# Altium project AJMG 2550XD Silver Jubilee.PrjPcb (part 2 of 2)
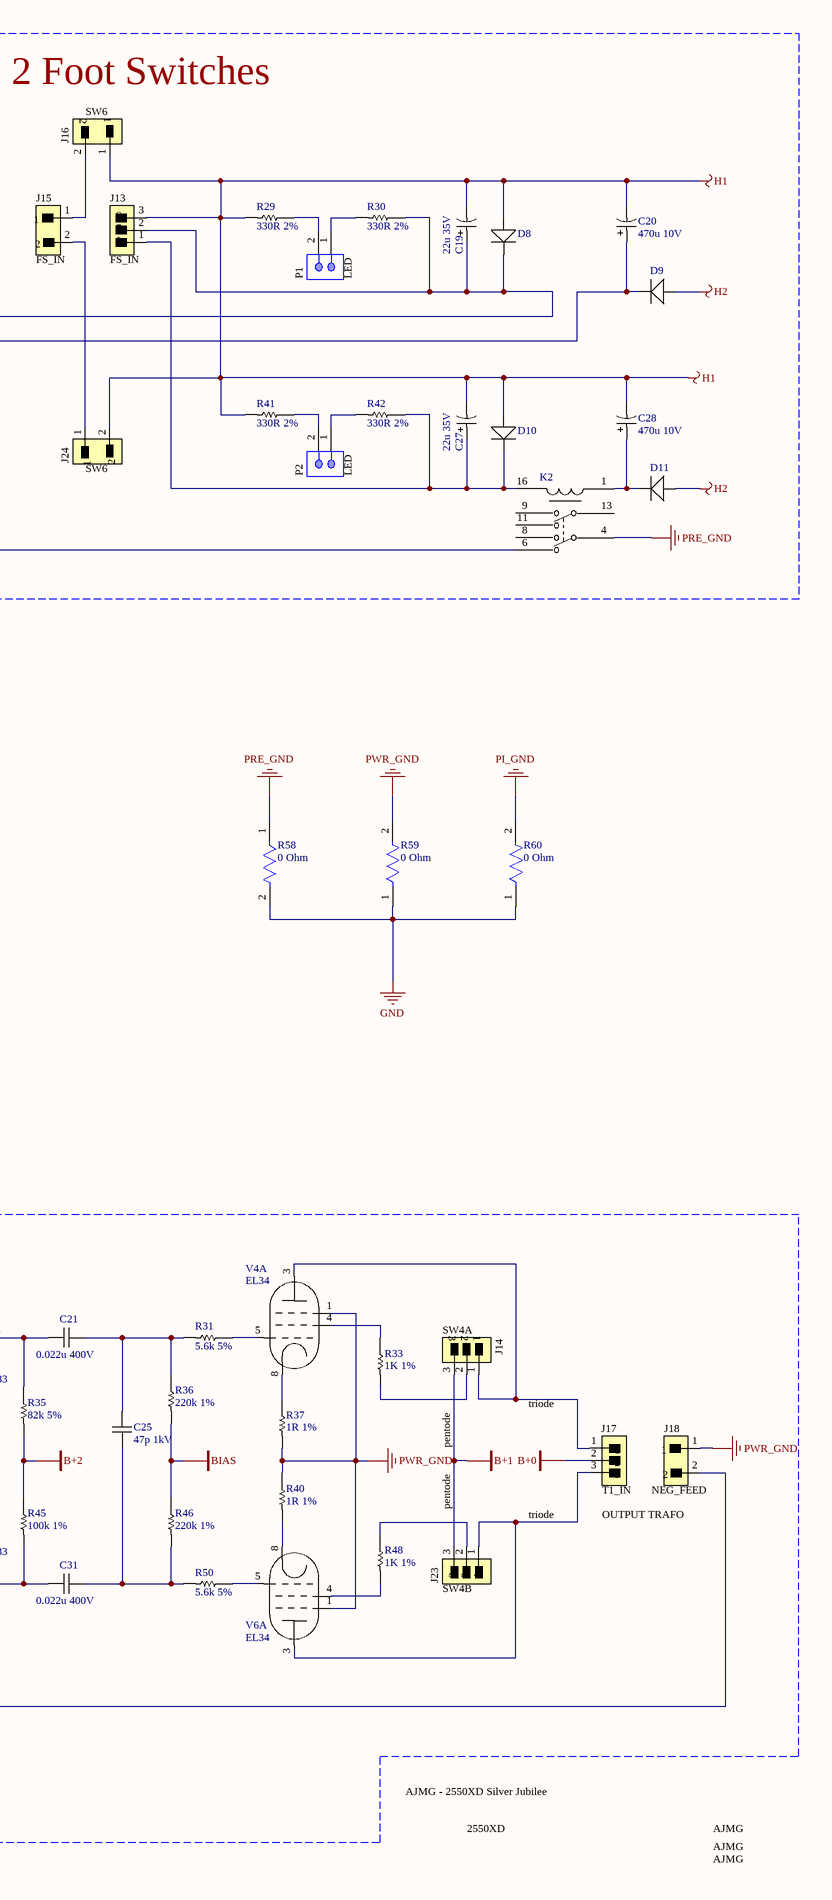
[diagram p2: AJMG 2550XD Silver Jubilee.SchDoc, right]

## Sheet AJMG 2550XD Silver Jubilee.SchDoc (continued)

### Library data of the parts
C1 C32 = FKP2J004701D00KSSD: CAP FILM THT 7.2x4.5 470pF 630V 10%; Manufacturer: WIMA; Voltage Rating (AC): 250V; Dielectric: PP; Supplier 1: Mouser; Manufacturer Part Number: FKP2J004701D00KSSD; RoHS: Yes; Category: Film Capacitors; Stock 1: 4441; Pricing 1: 1=0,36000, 10=0,25600, 50=0,25600, 100=0,15300, 1000=0,09700, 10000=0,08100 (USD); Case/Package: Radial; Min Operating Temperature: -55°C; Max Operating Temperature: 100°C; Capacitance: 470pF; Voltage Rating (DC): 630V; Tolerance: 10%; Termination: Radial; Length: 7.2mm; Width: 4.5mm; Height: 6mm; Lead Pitch: 5mm; RoHS Compliant: Yes; ComponentLink1URL: https://datasheet.ciiva.com/48407/hifkp2-dat-e-48407899.pdf?src-supplier=Distrelec; ComponentLink1Description: https://datasheet.ciiva.com/48407/hifkp2-dat-e-48407899.pdf?src-supplier=Distrelec; Supplier Part Number 1: 505-FKP2470/630/10
C2 = 890303322005CS: CAP FILM THT 10.5x5 0.033uF 630V 5%; Manufacturer: Wurth Elektronik; Insulation Resistance: 30000MOhm; Dissipation Factor@1kHz: 0.1%; Capacitance: 33nF; Dissipation Factor@100kHz: 0.15%; Rated Voltage: 630VDC; Rate of Voltage Rise: 700V/us; Pitch: 7.5mm; Technical Reference: MPPP075333J630DCPP45004; Capacitance Tolerance: +/-5%; ComponentLink1Description: Manufacturer; ComponentLink1URL: http://www.we-online.de; ComponentLink2Description: Datasheet; ComponentLink2URL: https://www.we-online.com/catalog/datasheet/890303322005CS.pdf; Length: 10.5mm; Mounting Technology: THT; Operating Temperature: -40 to +105degC; Manufacturer Part Number: 890303322005CS; Width: 5mm; Dissipation Factor@10kHz: 0.1%; Height: 11mm; Packaging: Carton; Published Date: May 2020
C3 C13 = FKP2J011001D00KI00: CAP FILM THT 7.2x4.5 0.001uF 630V 10%; Manufacturer: WIMA; Capacitance: 1nF; Dielectric: PP; Lead Diameter: 0.5mm; Supplier 1: Mouser; Manufacturer Part Number: FKP2J011001D00KI00; RoHS: Yes; Category: Uncategorized; Stock 1: 6998; Pricing 1: 1=0,38000, 10=0,26600, 50=0,26600, 100=0,15900, 1000=0,10100, 10000=0,08500 (USD); Case/Package: Radial; Min Operating Temperature: -55°C; Max Operating Temperature: 100°C; Tolerance: 10%; Packaging: Tape and Reel; Length: 7.2mm; Depth: 4.5mm; Lead Pitch: 5mm; ComponentLink1URL: http://components.arrow.com/part/dataview/0323_03186601?src-supplier=Arrow+Europe; ComponentLink1Description: http://components.arrow.com/part/dataview/0323_03186601?src-supplier=Arrow+Europe; Supplier Part Number 1: 505-FKP2J011001D00KI
C4 C6 C12 C21 C22 C31 = MKP4G022203C00KSSD: CAP FILM THT 13x4 0.022uF 400V 10%; Manufacturer: WIMA; Capacitance: 22nF; Dielectric: PP; Type: General Purpose; Lead Diameter: 0.6mm; Supplier 1: Mouser; Manufacturer Part Number: MKP4G022203C00KSSD; RoHS: Yes; Category: Film Capacitors; Stock 1: 2521; Pricing 1: 1=0,38000, 10=0,27200, 50=0,27200, 100=0,17900, 1000=0,11700, 10000=0,09600 (USD); Case/Package: Radial; Min Operating Temperature: -55°C; Max Operating Temperature: 100°C; Packaging: Bulk; Tolerance: 10%; Voltage Rating: 400V; Termination: Radial; Dissipation Factor: 10%; Series: MKP4; Construction: RADIAL; Length: 13mm; Width: 4mm; Height: 9mm; Lead Pitch: 10mm; Depth: 4mm; RoHS Compliant: Yes; ComponentLink1URL: http://components.arrow.com/part/dataview/0323_02831633?src-supplier=Arrow+Europe; ComponentLink1Description: http://components.arrow.com/part/dataview/0323_02831633?src-supplier=Arrow+Europe; ComponentLink2URL: http://www.mouser.com/ds/2/440/e_WIMA_MKP_4-1139861.pdf?src-supplier=Mouser; ComponentLink2Description: http://www.mouser.com/ds/2/440/e_WIMA_MKP_4-1139861.pdf?src-supplier=Mouser; Supplier Part Number 1: 505-MKP4.022/400/10P
C5 C18 C26 C29 C30 C35 C36 = MPX104K305D: CAP FILM THT 13x6 0.1uF 305V(AC) 10%; Manufacturer: Cornell Dubilier; Supplier 1: Mouser; Manufacturer Part Number: MPX104K305D; RoHS: No; Stock 1: 2661; Pricing 1: 1=0,41000, 10=0,20200, 50=0,20200, 100=0,12800, 1000=0,10800, 10000=0,08800 (USD); Supplier Part Number 1: 598-MPX104K305D
C7 = MKP10-4700/1KV/10P10: CAP FILM THT 13x4 4700pF 1kV 10%; Manufacturer: WIMA; Supplier 1: Mouser; Manufacturer Part Number: MKP10-4700/1KV/10P10; RoHS: No; Stock 1: 2404; Pricing 1: 1=0,40000, 10=0,28700, 50=0,28700, 100=0,18900, 1000=0,12300, 10000=0,10100 (USD); Supplier Part Number 1: 505-MKP147001KV10P1
C8 = 890283425002CS: CAP FILM THT 18x5 220nF 400V 10%; Manufacturer: Wurth Elektronik; Insulation Resistance: 9000MOhm; Dissipation Factor@1kHz: 1%; Capacitance Tolerance: +/-10%; Dissipation Factor@100kHz: 3.6%; Dissipation Factor@10kHz: 1.5%; Rated Voltage: 400VDC; Rate of Voltage Rise: 12V/us; Pitch: 15mm; Technical Reference: MPSP015224K400DCPP45004; ComponentLink1Description: Manufacturer; ComponentLink1URL: http://www.we-online.de; ComponentLink2Description: Datasheet; ComponentLink2URL: https://www.we-online.com/catalog/datasheet/890283425002CS.pdf; Length: 18mm; Mounting Technology: THT; Operating Temperature: -40 to +85degC; Manufacturer Part Number: 890283425002CS; Width: 5mm; Height: 11mm; Packaging: Carton; Published Date: May 2020; Capacitance: 220nF
C9 = 890303422005CS: CAP FILM THT 10.5x6 0.047uF 630V 10%; Manufacturer: Wurth Elektronik; Insulation Resistance: 9000MOhm; Dissipation Factor@1kHz: 1%; Capacitance Tolerance: +/-10%; Dissipation Factor@100kHz: 2.2%; Dissipation Factor@10kHz: 1.4%; Rated Voltage: 630VDC; Rate of Voltage Rise: 100V/us; Pitch: 7.5mm; Technical Reference: MPSP075473K630DCPP45004; Capacitance: 47nF; ComponentLink1Description: Manufacturer; ComponentLink1URL: http://www.we-online.de; ComponentLink2Description: Datasheet; ComponentLink2URL: https://www.we-online.com/catalog/datasheet/890303422005CS.pdf; Length: 10.5mm; Mounting Technology: THT; Operating Temperature: -40 to +85degC; Manufacturer Part Number: 890303422005CS; Width: 6mm; Height: 12mm; Packaging: Carton; Published Date: May 2020
C10 C25 = CDV19EF470JO3F: CAP MICA THT 16.3x4.8 47pF 1kV 5%; Manufacturer: Cornell Dubilier; Temperature Coefficient: 100ppm/°C; Supplier 1: Mouser; Manufacturer Part Number: CDV19EF470JO3F; RoHS: Yes; Category: Mica Capacitors; Stock 1: 241; Pricing 1: 1=3,59000, 10=2,90000, 50=2,61000, 100=1,97000, 1000=1,56000, 10000=1,47000 (USD); Mount: Through Hole; Case/Package: Radial; Dielectric Material: Mica; Min Operating Temperature: -55°C; Max Operating Temperature: 125°C; Capacitance: 47pF; Voltage Rating: 1kV; Tolerance: 5%; Package Quantity: 50; Packaging: Bulk; Termination: Radial; Working Voltage: 1kV; Voltage Rating (DC): 1kV; Features: General Purpose; Series: CDV19; Length: 0.642inch; Width: 0.189inch; Height: 12.7mm; Lead Pitch: 0.343inch; Height - Seated (Max): 0.5inch; REACH SVHC: No SVHC; RoHS Compliant: Yes; ComponentLink1URL: https://datasheet.ciiva.com/254/cd10-254226.pdf?src-supplier=Digi-Key; ComponentLink1Description: https://datasheet.ciiva.com/254/cd10-254226.pdf?src-supplier=Digi-Key; ComponentLink2URL: https://datasheet.ciiva.com/22709/1731345-22709964.pdf?src-supplier=Element14; ComponentLink2Description: https://datasheet.ciiva.com/22709/1731345-22709964.pdf?src-supplier=Element14; Supplier Part Number 1: 598-CDV19EF470JO3F
C11 = CD19FD501JO3F: CAP MICA THT 16.3x5 500pF 500V 5%; Manufacturer: Cornell Dubilier; Temperature Coefficient: 70ppm/°C; Supplier 1: Mouser; Manufacturer Part Number: CD19FD501JO3F; RoHS: Yes; Category: Mica Capacitors; Stock 1: 504; Pricing 1: 1=2,75000, 10=2,49000, 50=2,27000, 100=1,74000, 1000=1,47000, 10000=1,38000 (USD); Mount: Through Hole,PCB; Case/Package: Radial; Number of Pins: 2; Dielectric Material: Mica; Min Operating Temperature: -55°C; Max Operating Temperature: 125°C; Package Quantity: 50; Capacitance: 500pF; Voltage Rating: 500V; Tolerance: 5%; Packaging: Bulk; Voltage Rating (DC): 500V; Termination: Radial; Voltage: 500V; Features: General Purpose; Series: CD19; Construction: RADIAL; Length: 0.642inch; Width: 0.201inch; Height: 0.51inch; Lead Pitch: 0.343inch; Height - Seated (Max): 0.512inch; REACH SVHC: No SVHC; Lead Free: Lead Free; RoHS Compliant: Yes; ComponentLink1URL: https://datasheet.ciiva.com/14605/70189489-14605710.pdf?src-supplier=Allied+Electronics; ComponentLink1Description: https://datasheet.ciiva.com/14605/70189489-14605710.pdf?src-supplier=Allied+Electronics; ComponentLink2URL: https://datasheet.ciiva.com/1459/87234-1459863.pdf?src-supplier=Element14; ComponentLink2Description: https://datasheet.ciiva.com/1459/87234-1459863.pdf?src-supplier=Element14; Supplier Part Number 1: 598-CD19FD501JO3F
C14 = UKL2AR68KDD1TA: CAP ALUM THT D5xH11 0.68uF 100V 20%; Manufacturer: Nichicon; Capacitance: 680nF; Polarity: Polar; Ripple Current: 14.5mA; Life (Hours): 2000Hour; Supplier 1: Mouser; Manufacturer Part Number: UKL2AR68KDD1TA; RoHS: Yes; Category: Aluminum Electrolytic Capacitors; Pricing 1: 1=0,36000, 10=0,25000, 50=0,20500, 100=0,15000, 1000=0,09500, 10000=0,08500 (USD); Mount: Through Hole; Case/Package: Radial; Min Operating Temperature: -40°C; Max Operating Temperature: 85°C; Package Quantity: 2000; Packaging: Tape and Reel; Voltage Rating: 100V; Tolerance: 20%; Lead Pitch: 0.079inch; Height - Seated (Max): 0.472inch; RoHS Compliant: Yes; ComponentLink1URL: http://nichicon-us.com/english/products/pdfs/e-ukl.pdf?src-supplier=Digi-Key; ComponentLink1Description: http://nichicon-us.com/english/products/pdfs/e-ukl.pdf?src-supplier=Digi-Key; Supplier Part Number 1: 647-UKL2AR68KDD1TA
C15 = 100PK10MEFC5X11: CAP ALUM THT D5xH11 10uF 100V 20%; Manufacturer: Rubycon; Ripple Current: 75mA; Leakage Current: 3uA; Life (Hours): 2000Hour; Lead Diameter: 0.5mm; Supplier 1: Mouser; Manufacturer Part Number: 100PK10MEFC5X11; RoHS: Yes; Category: Aluminum Electrolytic Capacitors; Stock 1: 2901; Pricing 1: 1=0,25000, 10=0,17000, 50=0,17000, 100=0,05800, 1000=0,04900, 10000=0,04300 (USD); Mount: Through Hole; Case/Package: Radial; Min Operating Temperature: -40°C; Max Operating Temperature: 85°C; Capacitance: 10uF; Tolerance: 20%; Termination: Radial; Package Quantity: 3000; Voltage Rating: 100V; Packaging: Bulk; Ripple Current (AC): 75mA; Voltage: 100V; Voltage Rating (DC): 100V; Series: PK; Construction: RADIAL; Diameter: 5mm; Height: 11mm; Lead Pitch: 2mm; Height - Seated (Max): 0.492inch; Radiation Hardening: No; REACH SVHC: No SVHC; RoHS Compliant: Yes; ComponentLink1URL: https://datasheet.ciiva.com/11691/e-pk-11691642.pdf?src-supplier=Avnet; ComponentLink1Description: https://datasheet.ciiva.com/11691/e-pk-11691642.pdf?src-supplier=Avnet; ComponentLink2URL: https://datasheet.ciiva.com/17515/e-pk-17515194.pdf?src-supplier=Avnet+Europe; ComponentLink2Description: https://datasheet.ciiva.com/17515/e-pk-17515194.pdf?src-supplier=Avnet+Europe; Supplier Part Number 1: 232-100PK10MEFC5X11
C16 C33 = TAD SILVER MICA CAPS: CAP MICA THT AxB 0.002uF 500V 5%
C17 = TVA1306: CAP ALUM THT AXIAL D6.35xH17.45 25uF 50V 20%; Manufacturer: Vishay; Dielectric Material: Aluminium; Polarity: Polar; Supplier 1: Mouser; Manufacturer Part Number: TVA1306; RoHS: No; Category: Aluminum Electrolytic Capacitors; Stock 1: 1574; Pricing 1: 1=2,84000, 10=2,84000, 50=2,20000, 100=1,95000, 1000=1,77000, 10000=1,77000 (USD); Mount: Through Hole; Case/Package: Axial; Number of Pins: 2; Min Operating Temperature: -40°C; Max Operating Temperature: 85°C; Packaging: Bulk; Package Quantity: 560; Voltage Rating: 50V; Capacitance: 25uF; Series: TVA ATOM®; Voltage Rating (DC): 50V; Termination: Axial; Tolerance: 20%; Diameter: 6.35mm; Length: 0.687inch; Height: 17.5mm; Radiation Hardening: No; RoHS Compliant: No; Lead Free: Lead Free; ComponentLink1URL: https://datasheet.ciiva.com/11700/tvatom-11700487.pdf?src-supplier=Avnet; ComponentLink1Description: https://datasheet.ciiva.com/11700/tvatom-11700487.pdf?src-supplier=Avnet; Supplier Part Number 1: 75-TVA1306
C19 C27 = 860010572003: CAP ALUM THT D5xH11 22uF 35V 20%; Manufacturer: Wurth Elektronik; Ripple Current: 108mA; Rated Voltage: 35VDC; Technical Reference: ATBC110220M035DSPA3B000; Leakage Current: 7.7uA; Endurance: 2000h; Dissipation Factor: 12%; Capacitance Tolerance: +/-20%; ComponentLink2Description: Datasheet; Published Date: October 2020; Packaging: Ammo Pack; Operating Temperature: -40 to +85degC; Mounting Technology: THT; Manufacturer Part Number: 860010572003; Height: 11mm; Diameter: 5mm; ComponentLink2URL: https://www.we-online.com/catalog/datasheet/860010572003.pdf; ComponentLink1URL: http://www.we-online.de; ComponentLink1Description: Manufacturer; Capacitance: 22uF
C20 C28 = 860010273011: CAP ALUM THT D6.3xH11 470uF 10V 20%; Manufacturer: Wurth Elektronik; Ripple Current: 418mA; Rated Voltage: 10VDC; Technical Reference: ATBD110471M010DSPA4B000; Leakage Current: 47uA; Endurance: 2000h; Dissipation Factor: 19%; Capacitance Tolerance: +/-20%; ComponentLink2Description: Datasheet; Published Date: October 2020; Packaging: Ammo Pack; Operating Temperature: -40 to +85degC; Mounting Technology: THT; Manufacturer Part Number: 860010273011; Height: 11mm; Diameter: 6.3mm; ComponentLink2URL: https://www.we-online.com/catalog/datasheet/860010273011.pdf; ComponentLink1URL: http://www.we-online.de; ComponentLink1Description: Manufacturer; Capacitance: 470uF
C23 = FKP2J014701I00JSSD: CAP FILM THT 7.2x6.5 0.0047uF 630V 5%; Manufacturer: WIMA; Capacitance: 4.7nF; Dielectric: PP; Lead Diameter: 0.5mm; Supplier 1: Mouser; Manufacturer Part Number: FKP2J014701I00JSSD; RoHS: Yes; Category: Uncategorized; Stock 1: 2425; Pricing 1: 1=0,40000, 10=0,28800, 50=0,28800, 100=0,18900, 1000=0,12600, 10000=0,10100 (USD); Case/Package: Radial; Min Operating Temperature: -55°C; Max Operating Temperature: 100°C; Tolerance: 5%; Packaging: Bulk; Construction: RADIAL; Length: 7.2mm; Depth: 6.5mm; Lead Pitch: 5mm; RoHS Compliant: Yes; ComponentLink1URL: http://components.arrow.com/part/dataview/0323_02828315?src-supplier=Arrow+Europe; ComponentLink1Description: http://components.arrow.com/part/dataview/0323_02828315?src-supplier=Arrow+Europe; Supplier Part Number 1: 505-FKP2J014701I00JS
C24 = CDV16FF221JO3F: CAP MICA THT 10.9x3.8 220pF 1kV 5%; Manufacturer: Cornell Dubilier; Supplier 1: Mouser; Manufacturer Part Number: CDV16FF221JO3F; RoHS: Yes; Category: Mica Capacitors; Stock 1: 797; Pricing 1: 1=2,08000, 10=1,44000, 50=1,44000, 100=1,32000, 1000=0,92500, 10000=0,76800 (USD); Mount: Through Hole; Case/Package: Radial; Dielectric Material: Mica; Min Operating Temperature: -55°C; Max Operating Temperature: 150°C; Package Quantity: 50; Capacitance: 220pF; Voltage Rating: 1kV; Tolerance: 5%; Packaging: Bulk; Termination: Radial; Voltage Rating (DC): 1kV; Series: CDV16; Length: 0.429inch; Width: 0.15inch; Height: 11.7mm; Lead Pitch: 0.234inch; Height - Seated (Max): 0.461inch; RoHS Compliant: Yes; ComponentLink1URL: https://datasheet.ciiva.com/254/cd-cdv16-254715.pdf?src-supplier=Digi-Key; ComponentLink1Description: https://datasheet.ciiva.com/254/cd-cdv16-254715.pdf?src-supplier=Digi-Key; Supplier Part Number 1: 598-CDV16FF221JO3F
C34 = 890493422002CS: CAP FILM THT 10.5x6 0.01uF 1kV 10%; Manufacturer: Wurth Elektronik; Insulation Resistance: 9000MOhm; Dissipation Factor@1kHz: 1%; Capacitance Tolerance: +/-10%; Dissipation Factor@100kHz: 2.2%; Dissipation Factor@10kHz: 1.4%; Rated Voltage: 1000VDC; Rate of Voltage Rise: 160V/us; Pitch: 7.5mm; Technical Reference: MPSP075103KA00DCPP45004; Capacitance: 10nF; ComponentLink1Description: Manufacturer; ComponentLink1URL: http://www.we-online.de; ComponentLink2Description: Datasheet; ComponentLink2URL: https://www.we-online.com/catalog/datasheet/890493422002CS.pdf; Length: 10.5mm; Mounting Technology: THT; Operating Temperature: -40 to +85degC; Manufacturer Part Number: 890493422002CS; Width: 6mm; Height: 12mm; Packaging: Carton; Published Date: May 2020
D1 D2 = LTST-C930CKT: DIODE LED SMD; Manufacturer Part Number: LTST-C930KSKT; Manufacturer: Lite-On; Forward Current: 20mA; Colour: Yellow; Forward Voltage: 2V; Led Orientation: Top View; Wavelength: 594.5nm; Luminous Intensity: 800mcd; Power Dissipation: 75mW; Peak Emmision Wavelength: 588nm; Viewing Angle: 25°; Reverse Voltage: 5V; Package: LTST-C930KSKT; Digikey Description: LED YELLOW CLEAR CHIP SMD; Temperature Range High: +85°C; ComponentLink2Description: Datasheet; Octopart: https://octopart.com/ltst-c930kskt-lite-on-549925; ComponentLink2URL: http://optoelectronics.liteon.com/upload/download/DS22-2000-095/LTST-C930KSKT.pdf; Automotive: No; Device Class L3: unset; Height: 2.5mm; Device Class L1: Optoelectronics; Category: Diode; Device Class L2: LEDs; Temperature: -55°C to +85°C; Temperature Range Low: -55°C; Lead Free: Yes; RoHS: TRUE
D3-D11 = 1N4007-T: DIODE / 1.0 A Rectifier, 8 pF, 1000 V, -65 to 150 degC, 2-Pin DO-41 Plastic, RoHS, Tape and Reel; Manufacturer: Diodes Inc; Max. Average Rectified Current IO (A): 1; CT (pF): 8; Max. IR (uA): 5; VRRM (V): 1000; Max. IFSM (A): 30; Mounting Technology: Through Hole; Packing: Tape and Reel; ComponentLink1Description: Manufacturer URL; DatasheetVersion: Rev. 8-2; PackageDescription: 2-Pin Axial Lead, Body 4.635 x 2.36 mm, Lead Spread 25.4 mm; PartNumber: 1N4007-T; ComponentLink2Description: Datasheet; RoHS: TRUE; ComponentLink1URL: http://diodes.com/; ComponentLink2URL: http://diodes.com/datasheets/ds28002.pdf; Operating Temperature Range (degC): -65 to 150; VF (V): 1; PackageReference: DO-41-P-2
J1 J4 J5 J7 J9-J11 J13 J14 J17 J19-J23 J25-J27 J32 = CMP-04776-000004-1: CONN HEADER VERT 3POS 3MM; Manufacturer: Molex; Conn Gender: Male; Number Of Contacts: 3; Conn Orientation: Vertical; Current Rating: 8.5A; Voltage Rating: 600V; Digikey Description: CONN HEADER VERT 3POS 3MM; Manufacturer Part Number: 43650-0320; Number Of Rows: 1; Temperature Range High: +105°C; ComponentLink2Description: Datasheet; ComponentLink2URL: https://www.molex.com/webdocs/datasheets/pdf/en-us/0436500320_PCB_HEADERS.pdf; Device Class L2: Headers and Wire Housings; Temperature: -40°C to +105°C; Pitch: 3mm; Device Class L3: unset; Package: 0; Temperature Range Low: -40°C; Footprint Url: https://www.molex.com/pdm_docs/sd/436500320_sd.pdf; Device Class L1: Connectors; Lead Free: Yes; Category: Conn; Contact Material: Gold,Nickel; Automotive: No; RoHS: TRUE; Octopart: https://octopart.com/43650-0320-molex-7670312; Height: 10.15mm
J2 J3 = RCJ-021: CONN RCA JACK MONO 3.2MM PCB; pin to pad: 1>1A+1B; Manufacturer: CUI; Body Material: Brass; Body Color: Silver; Gender: Female; Shielding: Shielded; Number of Ports: 1; Supplier 1: Mouser; Manufacturer Part Number: RCJ-021; RoHS: Yes; Category: Audio / Video Connectors; Stock 1: 674; Pricing 1: 1=0,88000, 10=0,69900, 50=0,69900, 100=0,60800, 1000=0,48600, 10000=0,48600 (USD); Mount: Through Hole; Case/Package: Metal; Contact Plating: Nickel; Color: Black; Insulation Color: Black; Packaging: Bulk; Termination: Solder; Orientation: Vertical; Connector Type: Jack; Series: RCJ; Diameter: 3.5mm; Lead Free: Lead Free; RoHS Compliant: Yes; ComponentLink1URL: https://www.cui.com/product/resource/digikeypdf/rcj-02x.pdf?src-supplier=Digi-Key; ComponentLink1Description: https://www.cui.com/product/resource/digikeypdf/rcj-02x.pdf?src-supplier=Digi-Key; Supplier Part Number 1: 490-RCJ-021
J6 J8 J12 J15 J16 J18 J24 J28-J31 J33 = CMP-04776-000041-1: CONN HEADER VERT 2POS 3MM; Manufacturer: Molex; Voltage Rating: 600V; Conn Orientation: Vertical; Conn Gender: Male; Number Of Contacts: 2; Current Rating: 8.5A; ComponentLink2URL: https://www.molex.com/webdocs/datasheets/pdf/en-us/0436500229_PCB_HEADERS.pdf; ComponentLink2Description: Datasheet; Mouser Description: Headers & Wire Housings MicroFit 3.0 SR V TH Peg 30Au 2Ckt; Category: Conn; Height: 10.15mm; Contact Material: Gold,Nickel; Octopart: https://octopart.com/43650-0229-molex-7652326; Manufacturer Part Number: 43650-0229; Device Class L3: unset; Digikey Description: CONN HEADER VERT 2POS 3MM; Temperature Range Low: -40°C; Temperature Range High: +105°C; Pitch: 3mm; Package: 0; RoHS: TRUE; Device Class L1: Connectors; Lead Free: Yes; Temperature: -40°C to +105°C; Number Of Rows: 1; Automotive: No; Device Class L2: Headers and Wire Housings; Footprint Url: https://www.molex.com/pdm_docs/sd/436500229_sd.pdf
K1 K2 = CMP-03395-000111-1: RELAY TELECOM DPDT 3A 5V; Manufacturer: TE Connectivity; Number Of Contacts: 2; Standoff Height: 0.2mm; Coil Resistance: 125Ω; Coil Power: 200mW; Coil Type: Non-Latching; Manufacturer Part Number: 9-1393792-3; Automotive: No; Package: 9-1393792-3; Device Class L2: Relays; ComponentLink2Description: Datasheet; Ambient Temperature Range High: +85°C; Device Class L1: Electromechanical; Octopart: https://octopart.com/9-1393792-3-te+connectivity-41192813; Category: Relay; Current Rating: 3A; Digikey Description: RELAY TELECOM DPDT 3A 5V; Coil Voltage: 5V; RoHS: TRUE; Height: 10.9mm; ComponentLink2URL: https://www.te.com/usa-en/product-9-1393792-3.html?te_bu=Cor&te_type=other&te_campaign=oct_glo_cor-oct-global-oth-prtnr-fy19-oct-octo-buy-bom_sma-298_2&elqCampaignId=35216; Lead Free: Yes; Ambient Temperature Range Low: -40°C; Throw Configuration: DPDT; Switching Current: 3A; Device Class L3: Power Relays
P1 P2 = CMP-2000-05537-1: Male Header, Pitch 2.54 mm, 1 x 2 Position, Height 11.7 mm, Tail Length 3.56 mm, 0 to 75 degC, RoHS, Bulk; Manufacturer: Molex; PartNumber: 0022272021; Current rating: 4A; Package Version: Rev. BC, 02/2012; Voltage rating: 250V; No. of Positions: 2; Pitch: 2.54mm; No. of Rows: 1; Orientation: Vertical; Operating temperature: 0°Cto+75°C; Manufacturer URL: http://www.molex.com/; Mounting Technology: ThroughHole; Housing material: Nylon(UL94V-0); Package Description: 2-Leads Header, Body 5.08 x 5.8 mm, Pitch 2.54 mm; Voltage - Max: 250V; Datasheet URL: http://www.molex.com/pdm_docs/sd/022272021_sd.pdf; Package Reference: 22-27-2021; Contact material: Tinplatedbrass; Current - Max: 4A; Datasheet Version: Rev. F, 06/2009
R1-R3 R5 R8 R14 R15 R38 R39 R45 R51 R53 R55 = CMP2010-FX-1003ELF: RES SMD 2010 100K 1% 1W; Manufacturer: Bourns; Supplier 1: Mouser; Manufacturer Part Number: CMP2010-FX-1003ELF; RoHS: Yes; Stock 1: 403; Pricing 1: 1=0,16000, 10=0,12500, 50=0,10700, 100=0,09800, 1000=0,06400, 10000=0,05900 (USD); Supplier Part Number 1: 652-CMP2010-FX-1003L
R4 = CRM2010-FX-4703ELF: RES SMD 2010 470K 1% 1W
R6 R13 = CHP2512-JW-103ELF: RES SMD 2512 10K 5% 3W; Manufacturer: Bourns; Resistance: 10kR; Temperature Coefficient: 200ppm/°C; Supplier 1: Mouser; Manufacturer Part Number: CHP2512-JW-103ELF; RoHS: Yes; Stock 1: 9815; Pricing 1: 1=0,88000, 10=0,40900, 50=0,40900, 100=0,27300, 1000=0,17400, 10000=0,16500 (USD); Case/Package: 2512; Case Code (Imperial): 2512; Case Code (Metric): 6432; Min Operating Temperature: -55°C; Max Operating Temperature: 155°C; Resistor Type: Thick Film; Features: Moisture Resistant; Packaging: Tape and Reel; Tolerance: 5%; Max Power Dissipation: 3W; Number of Terminations: 2; ComponentLink1URL: https://www.bourns.com/docs/product-datasheets/chp.pdf?sfvrsn=21d57df6_2&src-supplier=Digi-Key; ComponentLink1Description: https://www.bourns.com/docs/product-datasheets/chp.pdf?sfvrsn=21d57df6_2&src-supplier=Digi-Key; Supplier Part Number 1: 652-CHP2512JW103ELF
R7 R11 R16 = CMP2512-FX-4702ELF: RES SMD 2512 47K 1% 1.5W; Manufacturer: Bourns; Supplier 1: Mouser; Manufacturer Part Number: CMP2512-FX-4702ELF; RoHS: Yes
R9 R19 R34 R49 R52 = CMP2010-FX-1004ELF: RES SMD 2010 1M 1% 1W; Manufacturer: Bourns; Supplier 1: Mouser; Manufacturer Part Number: CMP2010-FX-1004ELF; RoHS: Yes; Stock 1: 8904; Pricing 1: 1=0,16000, 10=0,12500, 50=0,10700, 100=0,09800, 1000=0,06400, 10000=0,05900 (USD); Supplier Part Number 1: 652-CMP2010-FX-1004L
R10 R22 R26 R32 R36 R46 = CHV2010-FX-2203ELF: RES SMD 2010 220K 1% 1/2W; Manufacturer: Bourns JW Miller; Power Rating: 500mW; Resistance: 220kR; Working Voltage: 3kV; Temperature Coefficient: 100ppm/°C; Supplier 1: Mouser; Manufacturer Part Number: CHV2010-FX-2203ELF; RoHS: Yes; Category: Chip SMD Resistors; Stock 1: 26763; Pricing 1: 1=0,69000, 10=0,32000, 50=0,32000, 100=0,21400, 1000=0,13600, 10000=0,13000 (USD); Mount: Surface Mount; Case/Package: 2010; Case Code (Metric): 5025; Case Code (Imperial): 2010; Min Operating Temperature: -55°C; Max Operating Temperature: 155°C; Tolerance: 1%; Packaging: Cut Tape; Resistor Type: Thick Film; Number of Terminations: 2; Termination: Solder; Voltage Rating: 3kV; Max Power Dissipation: 500mW; Voltage Rating (DC): 3kV; Length: 0.197inch; Width: 0.098inch; Height: 0.028inch; Depth: 2.5mm; REACH SVHC: No SVHC; RoHS Compliant: Yes; ComponentLink1URL: http://uk.rs-online.com/webdocs/13ff/0900766b813ff008.pdf?src-supplier=RSComponents; ComponentLink1Description: http://uk.rs-online.com/webdocs/13ff/0900766b813ff008.pdf?src-supplier=RSComponents; ComponentLink2URL: http://www.alliedelec.com/images/products/datasheets/bm/BOURNS/70479526.pdf?src-supplier=Allied+Electronics; ComponentLink2Description: http://www.alliedelec.com/images/products/datasheets/bm/BOURNS/70479526.pdf?src-supplier=Allied+Electronics; ComponentLink3URL: http://www.farnell.com/datasheets/2059762.pdf?src-supplier=Farnell; ComponentLink3Description: http://www.farnell.com/datasheets/2059762.pdf?src-supplier=Farnell; ComponentLink4URL: http://www.bourns.com/docs/Product-Datasheets/CHV.pdf?src-supplier=Digi-Key; ComponentLink4Description: http://www.bourns.com/docs/Product-Datasheets/CHV.pdf?src-supplier=Digi-Key; ComponentLink5URL: http://www.farnell.com/datasheets/2059762.pdf?src-supplier=Element14; ComponentLink5Description: http://www.farnell.com/datasheets/2059762.pdf?src-supplier=Element14; ComponentLink6URL: https://www.bourns.com/docs/Product-Datasheets/CHV.pdf?src-supplier=Digi-Key; ComponentLink6Description: https://www.bourns.com/docs/Product-Datasheets/CHV.pdf?src-supplier=Digi-Key; ComponentLink7URL: http://www.bourns.com/data/global/pdfs/CHV.pdf?src-supplier=Avnet; ComponentLink7Description: http://www.bourns.com/data/global/pdfs/CHV.pdf?src-supplier=Avnet; Supplier Part Number 1: 652-CHV2010FX2203ELF
R12 = CMA02040X6802GB300: RES SMD 0204 68K 2% 400mW; Manufacturer: Vishay Beyschlag; Resistance: 68kR; Power Rating: 250mW; Voltage Rating: 200V; Body Diameter: 1.4mm; Supplier 1: Mouser; Manufacturer Part Number: CMA02040X6802GB300; RoHS: Yes; Category: Chip SMD Resistors; Stock 1: 2857; Pricing 1: 1=0,58000, 10=0,25800, 50=0,25800, 100=0,16500, 1000=0,10700, 10000=0,08900 (USD); Case/Package: 0204; Number of Pins: 2; Contact Plating: Tin; Case Code (Metric): 3614; Min Operating Temperature: -55°C; Max Operating Temperature: 155°C; Tolerance: 2%; Resistor Type: Carbon Film; Package Quantity: 1; Packaging: Tape and Reel; Number of Terminations: 2; Max Power Dissipation: 400mW; Voltage Rating (DC): 200V; Operating Supply Voltage: 200V; Features: Automotive AEC-Q200; Series: CMA; Technology: CARBON FILM; Construction: Cylindrical; Resistance Tolerance: 2%; Diameter: 1.4mm; Length: 3.6mm; Width: 3.6mm; Radiation Hardening: No; Military Standard: Not; Lead Free: Lead Free; RoHS Compliant: Yes; ComponentLink1URL: https://datasheet.ciiva.com/11811/0900766b80d9877c-11811894.pdf?src-supplier=RSComponents; ComponentLink1Description: https://datasheet.ciiva.com/11811/0900766b80d9877c-11811894.pdf?src-supplier=RSComponents; ComponentLink2URL: https://datasheet.ciiva.com/8896/cma0204-8896859.pdf?src-supplier=Avnet; ComponentLink2Description: https://datasheet.ciiva.com/8896/cma0204-8896859.pdf?src-supplier=Avnet; ComponentLink3URL: https://datasheet.ciiva.com/2501/cma0204-2501650.pdf?src-supplier=Digi-Key; ComponentLink3Description: https://datasheet.ciiva.com/2501/cma0204-2501650.pdf?src-supplier=Digi-Key; ComponentLink4URL: https://datasheet.ciiva.com/2501/cma0204-2501651.pdf?src-supplier=Digi-Key; ComponentLink4Description: https://datasheet.ciiva.com/2501/cma0204-2501651.pdf?src-supplier=Digi-Key; ComponentLink5URL: https://datasheet.ciiva.com/16887/cma0204-16887161.pdf?src-supplier=Avnet+Europe; ComponentLink5Description: https://datasheet.ciiva.com/16887/cma0204-16887161.pdf?src-supplier=Avnet+Europe; ComponentLink6URL: https://datasheet.ciiva.com/2501/cma0204-2501649.pdf?src-supplier=Digi-Key; ComponentLink6Description: https://datasheet.ciiva.com/2501/cma0204-2501649.pdf?src-supplier=Digi-Key; Supplier Part Number 1: 594-CMA02040X6802GB3
R17 R20 R43 R47 = CMP2010-FX-1002ELF: RES SMD 2010 10K 1% 1W; Manufacturer: Bourns; Supplier 1: Mouser; Manufacturer Part Number: CMP2010-FX-1002ELF; RoHS: Yes; Stock 1: 3934; Pricing 1: 1=0,16000, 10=0,12500, 50=0,10700, 100=0,09800, 1000=0,06400, 10000=0,05900 (USD); Supplier Part Number 1: 652-CMP2010-FX-1002L
R18 = CR2512-JW-223ELF: RES SMD 2512 22K 5% 1W; Manufacturer: Bourns; Resistance: 22kR; Temperature Coefficient: 200ppm/°C; Supplier 1: Mouser; Manufacturer Part Number: CR2512-JW-223ELF; RoHS: Yes; Category: Chip SMD Resistors; Mount: Surface Mount; Case/Package: 2512; Min Operating Temperature: -55°C; Max Operating Temperature: 155°C; Packaging: Tape and Reel; Power Rating: 1W; Tolerance: 5%; Package Quantity: 4000; Resistor Type: Thick Film; Number of Terminations: 2; Max Power Dissipation: 1W; Series: CR2512; Length: 0.248inch; Width: 0.122inch; Height: 0.03inch; RoHS Compliant: Yes; ComponentLink1URL: https://datasheet.ciiva.com/29507/cr2010-29507866.pdf?src-supplier=Digi-Key; ComponentLink1Description: https://datasheet.ciiva.com/29507/cr2010-29507866.pdf?src-supplier=Digi-Key; Supplier Part Number 1: 652-CR2512-JW-223ELF
R21 = SMW210RJT: RES SMD 2616 10R 5% 2W SMW2; Manufacturer: TE Connectivity; Temperature Coefficient: 200ppm/°C; Voltage Rating: 300V; Insulation Resistance: 10GR; Number of Resistors: 1; Supplier 1: Mouser; Manufacturer Part Number: SMW210RJT; RoHS: Yes; Category: Chip SMD Resistors; Stock 1: 5602; Pricing 1: 1=0,42000, 10=0,39200, 50=0,27700, 100=0,24800, 1000=0,16600, 10000=0,16600 (USD); Mount: Surface Mount; Case/Package: SMD/SMT; Case Code (Metric): 6740; Case Code (Imperial): 2616; Min Operating Temperature: -55°C; Max Operating Temperature: 280°C; Resistance: 10R; Tolerance: 5%; Power Rating: 2W; Resistor Type: Power resistor; Packaging: Tape and Reel; Termination: Solder; Number of Terminations: 2; Features: Flame Retardant Coating; Series: SMW, CGS; Max Power Dissipation: 2W; Resistance Tolerance: 5%; Technology: WIRE WOUND; Length: 6.7mm; Width: 4mm; Height: 3.55mm; Depth: 4mm; Radiation Hardening: No; RoHS Compliant: Yes; REACH SVHC: No SVHC; ELV: Compliant; ComponentLink1URL: https://datasheet.ciiva.com/11813/0900766b8087d7f5-11813052.pdf?src-supplier=RSComponents; ComponentLink1Description: https://datasheet.ciiva.com/11813/0900766b8087d7f5-11813052.pdf?src-supplier=RSComponents; ComponentLink2URL: https://datasheet.ciiva.com/14180/wysm-data-e-14180885.pdf?src-supplier=Distrelec; ComponentLink2Description: https://datasheet.ciiva.com/14180/wysm-data-e-14180885.pdf?src-supplier=Distrelec; Supplier Part Number 1: 571-SMW210RJT
R23 R25 = CR2512-JW-152ELF: RES SMD 2512 1.5k 5% 1W; Manufacturer: Bourns; Resistance: 1.5kR; Voltage Rating: 200V; Temperature Coefficient: 200ppm/°C; Supplier 1: Mouser; Manufacturer Part Number: CR2512-JW-152ELF; RoHS: Yes; Category: Chip SMD Resistors; Stock 1: 1351; Pricing 1: 1=0,34000, 10=0,15300, 50=0,15300, 100=0,08700, 1000=0,04800, 10000=0,03700 (USD); Mount: Surface Mount; Case/Package: 2512; Case Code (Metric): 6332; Case Code (Imperial): 2512; Contact Plating: Tin; Min Operating Temperature: -55°C; Max Operating Temperature: 155°C; Package Quantity: 4000; Packaging: Tape and Reel; Tolerance: 5%; Power Rating: 1W; Resistor Type: Thick Film; Number of Terminations: 2; Termination: SMD/SMT; Max Power Dissipation: 1W; Series: CR2512; Length: 0.248inch; Width: 0.122inch; Height: 0.03inch; Radiation Hardening: No; RoHS Compliant: Yes; ComponentLink1URL: https://datasheet.ciiva.com/9123/cr2010-9123461.pdf?src-supplier=Avnet; ComponentLink1Description: https://datasheet.ciiva.com/9123/cr2010-9123461.pdf?src-supplier=Avnet; ComponentLink2URL: https://datasheet.ciiva.com/14983/cr2010-14983047.pdf?src-supplier=Digi-Key; ComponentLink2Description: https://datasheet.ciiva.com/14983/cr2010-14983047.pdf?src-supplier=Digi-Key; ComponentLink3URL: https://datasheet.ciiva.com/5583/cr2010-5583083.pdf?src-supplier=Mouser; ComponentLink3Description: https://datasheet.ciiva.com/5583/cr2010-5583083.pdf?src-supplier=Mouser; Supplier Part Number 1: 652-CR2512-JW-152ELF
R24 = CMP2512AFX-2701ELF: RES SMD 2512 2.7K 1% 1.5W; Manufacturer: Bourns; Supplier 1: Mouser; Manufacturer Part Number: CMP2512AFX-2701ELF; RoHS: Yes; Supplier Part Number 1: 652-CMP2512AFX-2701L
R27 = CR2512-JW-122ELF: RES SMD 2512 1.2k 5% 1W; Manufacturer: Bourns; Resistance: 1.2kR; Voltage Rating: 200V; Temperature Coefficient: 200ppm/°C; Supplier 1: Mouser; Manufacturer Part Number: CR2512-JW-122ELF; RoHS: Yes; Category: Chip SMD Resistors; Stock 1: 949; Pricing 1: 1=0,40000, 10=0,17300, 50=0,17300, 100=0,10900, 1000=0,07100, 10000=0,05900 (USD); Mount: Surface Mount; Case/Package: 2512; Case Code (Imperial): 2512; Case Code (Metric): 6332; Contact Plating: Tin; Min Operating Temperature: -55°C; Max Operating Temperature: 155°C; Power Rating: 1W; Packaging: Tape and Reel; Package Quantity: 4000; Tolerance: 5%; Resistor Type: Thick Film; Termination: SMD/SMT; Number of Terminations: 2; Max Power Dissipation: 1W; Series: CR2512; Construction: Rectangular; Length: 6.3mm; Width: 3.2mm; Height: 0.03inch; Depth: 3.1mm; Radiation Hardening: No; Military Standard: Not; RoHS Compliant: Yes; ComponentLink1URL: https://datasheet.ciiva.com/14983/cr2010-14983045.pdf?src-supplier=Digi-Key; ComponentLink1Description: https://datasheet.ciiva.com/14983/cr2010-14983045.pdf?src-supplier=Digi-Key; Supplier Part Number 1: 652-CR2512-JW-122ELF
R28 = CR2512-FX-3001ELF: RES SMD 2512 3k 1% 1W; Manufacturer: Bourns; Resistance: 3kR; Voltage Rating: 200V; Temperature Coefficient: 100ppm/°C; Supplier 1: Mouser; Manufacturer Part Number: CR2512-FX-3001ELF; RoHS: Yes; Category: Chip SMD Resistors; Mount: Surface Mount; Case/Package: 2512; Case Code (Metric): 6332; Case Code (Imperial): 2512; Weight: 0.001429oz; Contact Plating: Tin; Min Operating Temperature: -55°C; Max Operating Temperature: 155°C; Packaging: Tape and Reel; Power Rating: 1W; Tolerance: 1%; Package Quantity: 4000; Resistor Type: Thick Film; Number of Terminations: 2; Termination: SMD/SMT; Max Power Dissipation: 1W; Series: CR2512; Length: 0.248inch; Width: 0.122inch; Height: 0.03inch; Radiation Hardening: No; RoHS Compliant: Yes; ComponentLink1URL: https://datasheet.ciiva.com/9123/cr2010-9123081.pdf?src-supplier=Avnet; ComponentLink1Description: https://datasheet.ciiva.com/9123/cr2010-9123081.pdf?src-supplier=Avnet; Supplier Part Number 1: 652-CR2512-FX3001ELF
R29 R30 R41 R42 = CMB02070X3300GB200: RES SMD 0207 330R 2% 1W; Manufacturer: Vishay Beyschlag; Operating Supply Voltage: 500V; Supplier 1: Mouser; Manufacturer Part Number: CMB02070X3300GB200; RoHS: Yes; Category: Chip SMD Resistors; Stock 1: 1511; Pricing 1: 1=0,45000, 10=0,45000, 50=0,40500, 100=0,31500, 1000=0,20600, 10000=0,18800 (USD); Case/Package: 0207; Min Operating Temperature: -55°C; Max Operating Temperature: 155°C; Package Quantity: 1; Resistance: 330R; Tolerance: 2%; Packaging: Tape and Reel; Resistor Type: Carbon Film; Number of Terminations: 2; Max Power Dissipation: 1W; Features: Automotive AEC-Q200; Series: CMB; Construction: Cylindrical; Diameter: 2.2mm; Length: 0.228inch; Military Standard: Not; Lead Free: Lead Free; RoHS Compliant: Yes; ComponentLink1URL: https://datasheet.ciiva.com/2482/cmb0207-2482449.pdf?src-supplier=Digi-Key; ComponentLink1Description: https://datasheet.ciiva.com/2482/cmb0207-2482449.pdf?src-supplier=Digi-Key; ComponentLink2URL: https://datasheet.ciiva.com/2482/cmb0207-2482450.pdf?src-supplier=Digi-Key; ComponentLink2Description: https://datasheet.ciiva.com/2482/cmb0207-2482450.pdf?src-supplier=Digi-Key; ComponentLink3URL: https://datasheet.ciiva.com/2482/cmb0207-2482451.pdf?src-supplier=Digi-Key; ComponentLink3Description: https://datasheet.ciiva.com/2482/cmb0207-2482451.pdf?src-supplier=Digi-Key; Supplier Part Number 1: 594-CMB02070X3300GB2
R31 R50 = CR2512-JW-562ELF: RES SMD 2512 5.6K 5% 1W; Manufacturer: Bourns; Resistance: 5.6kR; Tolerance: 1%; Temperature Coefficient: 200ppm/°C; Supplier 1: Mouser; Manufacturer Part Number: CR2512-JW-562ELF; RoHS: Yes; Category: Chip SMD Resistors; Pricing 1: 1=0,40000, 10=0,17300, 50=0,17300, 100=0,10900, 1000=0,07100, 10000=0,05900 (USD); Mount: Surface Mount; Case/Package: 2512; Min Operating Temperature: -55°C; Max Operating Temperature: 155°C; Packaging: Tape and Reel; Power Rating: 1W; Package Quantity: 4000; Resistor Type: Thick Film; Number of Terminations: 2; Max Power Dissipation: 1W; Series: CR2512; Length: 0.248inch; Width: 0.122inch; Height: 0.03inch; RoHS Compliant: Yes; ComponentLink1URL: https://datasheet.ciiva.com/29507/cr2010-29507882.pdf?src-supplier=Digi-Key; ComponentLink1Description: https://datasheet.ciiva.com/29507/cr2010-29507882.pdf?src-supplier=Digi-Key; Supplier Part Number 1: 652-CR2512-JW-562ELF
R33 R48 = 35501K0FT: RES SMD 3550 1K 1% 5W; Manufacturer: TE Connectivity; Supplier 1: Mouser; Manufacturer Part Number: 35501K0FT; Stock 1: 810; Pricing 1: 1=1,54000, 10=1,33000, 50=1,17000, 100=1,00000, 1000=0,61900, 10000=0,59900 (USD); ComponentLink1URL: http://datasheet.octopart.com/35501K0FT-TE-Connectivity-datasheet-129769421.pdf?src-supplier=Electro+Sonic; ComponentLink1Description: http://datasheet.octopart.com/35501K0FT-TE-Connectivity-datasheet-129769421.pdf?src-supplier=Electro+Sonic; ComponentLink2URL: http://sigma.octopart.com/129769425/technical_drawing/TE-Connectivity-35501K0FT.pdf?src-supplier=TE+Connectivity; ComponentLink2Description: http://sigma.octopart.com/129769425/technical_drawing/TE-Connectivity-35501K0FT.pdf?src-supplier=TE+Connectivity; Supplier Part Number 1: 279-35501K0FT
R35 = CRM2512-JW-823ELF: RES SMD 2512 82K 5% 2W; Manufacturer: Bourns; Resistance: 82kR; Temperature Coefficient: 200ppm/°C; Supplier 1: Mouser; Manufacturer Part Number: CRM2512-JW-823ELF; RoHS: Yes; Category: Chip SMD Resistors; Case/Package: 2512; Min Operating Temperature: -55°C; Max Operating Temperature: 155°C; Packaging: Tape and Reel; Resistor Type: Thick Film; Number of Terminations: 2; Tolerance: 5%; Max Power Dissipation: 2W; Length: 0.248inch; Width: 0.122inch; Height: 0.031inch; RoHS Compliant: Yes; ComponentLink1URL: http://www.bourns.com/docs/Product-Datasheets/CRM.pdf?src-supplier=Digi-Key; ComponentLink1Description: http://www.bourns.com/docs/Product-Datasheets/CRM.pdf?src-supplier=Digi-Key; Supplier Part Number 1: 652-CRM2512-JW823ELF
R37 R40 = WSC00021R000FEA: RES SMD 4527 1R 1% 2W; Manufacturer: Vishay Dale; Temperature Coefficient: 50ppm/°C; Supplier 1: Mouser; Manufacturer Part Number: WSC00021R000FEA; RoHS: Yes; Category: Chip SMD Resistors; Stock 1: 651; Pricing 1: 1=1,61000, 10=1,20000, 50=1,20000, 100=1,03000, 1000=0,73900, 10000=0,52200 (USD); Case/Package: 4527; Number of Pins: 2; Contact Plating: Tin,Matte; Size Code: 4527; Min Operating Temperature: -65°C; Max Operating Temperature: 275°C; Resistance: 1R; Power Rating: 2W; Tolerance: 1%; Packaging: Tape and Reel; Resistor Type: Wirewound; Resistance Tolerance: 1%; Radiation Hardening: No; REACH SVHC: Unknown; Lead Free: Lead Free; RoHS Compliant: Yes; ComponentLink1URL: https://datasheet.ciiva.com/16504/wscwsn-16504361.pdf?src-supplier=Future+Electronics; ComponentLink1Description: https://datasheet.ciiva.com/16504/wscwsn-16504361.pdf?src-supplier=Future+Electronics; ComponentLink2URL: https://datasheet.ciiva.com/7717/wscwsn-7717277.pdf?src-supplier=Element14; ComponentLink2Description: https://datasheet.ciiva.com/7717/wscwsn-7717277.pdf?src-supplier=Element14; ComponentLink3URL: https://datasheet.ciiva.com/9109/wscwsn-9109599.pdf?src-supplier=Avnet; ComponentLink3Description: https://datasheet.ciiva.com/9109/wscwsn-9109599.pdf?src-supplier=Avnet; Supplier Part Number 1: 71-WSC00021R000FEA
R44 R54 R56 = CRM2512-FX-4700ELF: RES SMD 2512 470R 1% 2W; Manufacturer: Bourns; Temperature Coefficient: 100ppm/°C; Supplier 1: Mouser; Manufacturer Part Number: CRM2512-FX-4700ELF; RoHS: Yes; Category: Chip SMD Resistors; Stock 1: 2137; Pricing 1: 1=0,60000, 10=0,37800, 50=0,37800, 100=0,19600, 1000=0,12000, 10000=0,10900 (USD); Case/Package: 2512; Min Operating Temperature: -55°C; Max Operating Temperature: 155°C; Package Quantity: 4000; Packaging: Tape and Reel; Resistance: 470R; Tolerance: 1%; Power Rating: 2W; Resistor Type: Thick Film; Number of Terminations: 2; Max Power Dissipation: 2W; Series: CRM2512; Construction: Rectangular; Length: 0.248inch; Width: 0.122inch; Height: 0.031inch; Depth: 3.1mm; Military Standard: Not; RoHS Compliant: Yes; ComponentLink1URL: https://datasheet.ciiva.com/29521/crm-29521783.pdf?src-supplier=Digi-Key; ComponentLink1Description: https://datasheet.ciiva.com/29521/crm-29521783.pdf?src-supplier=Digi-Key; Supplier Part Number 1: 652-CRM2512FX4700ELF
R57 = CMP-1018-00090-1: RES SMD 2512 4.7k 5% 1W; Value: 4700.00 Ohm; Case-EIA: 2512; Case-Metric: 6432; Tolerance: 5 %; Technology: SMT; Power: 1 W
R58-R60 = CMP-2005-01987-2: RES SMD 205K OHM 1% 1/2W 1992; Resistance: 0mR; Temperature Coefficient: 0ppm/°C; Max Power Dissipation: 500mW; Voltage Rating: 200V; Packaging: Tape and Reel; Max Operating Temperature: 155°C; REACH SVHC: No SVHC; Min Operating Temperature: -55°C; Package Quantity: 1; Length: 3.2mm; Case Code (Metric): 3225; Case/Package: 1210; Composition: Thick Film; Military Standard: Not; Contact Plating: Tin; Case Code (Imperial): 1210; Radiation Hardening: No; Depth: 2.5mm; Termination: SMD/SMT; Features: Automotive AEC-Q200; Width: 0.098inch; Mount: Surface Mount; Power Rating: 500mW; Weight: 0.000564oz; Number of Terminations: 2; Height: 0.55mm